# Altium schematic sheet altium.schdoc
size 243 x 176 mm
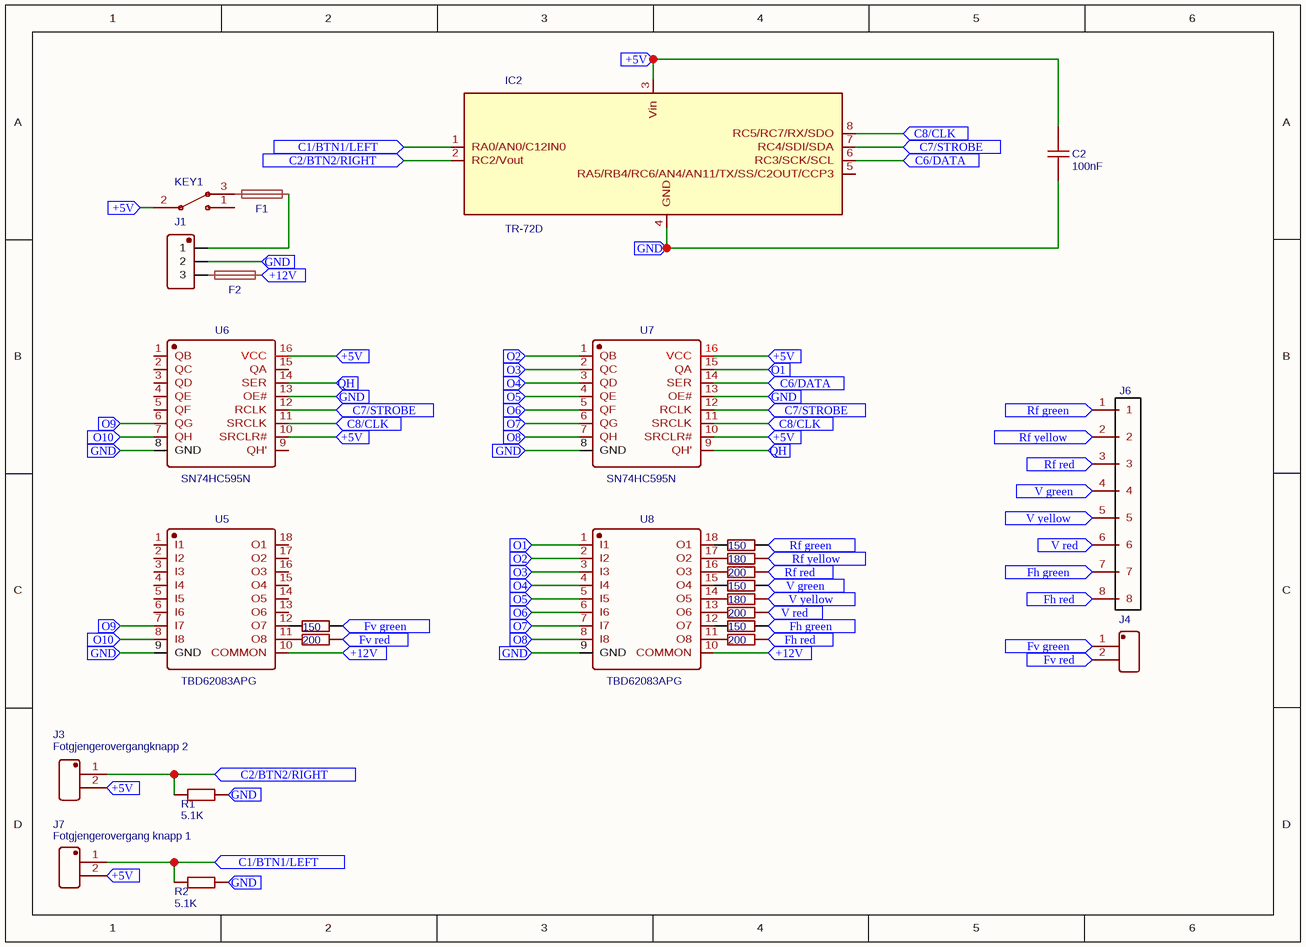
[diagram p0: altium.schdoc]

## Parts
C2  100nF  [1210]
F1  NO  [OMF_125]  (value not drawn)
F2  NO  [OMF_125]  (value not drawn)
IC2  TR-72D  [IQRF_KON-SIM-01]
J1  KF127_3P_5.08  [KF127_3P_5.08]  (value not drawn)
J3  Fotgjengerovergangknapp 2  [KF127_2P_5.08]
J4  KF127_2P_5.08  [KF127_2P_5.08]  (value not drawn)
J6  KF127-8P  [KF127-8P]  (value not drawn)
J7  Fotgjengerovergang knapp 1  [KF127_2P_5.08]
KEY1  MSK-11027 Toggle Switches  [MSK-11027]  (value not drawn)
R1  5.1K  [1206]
R2  5.1K  [1206]
R3  150  [1206]
R4  200  [1206]
R5  200  [1206]
R6  200  [1206]
R7  200  [1206]
R16  180  [1206]
R17  180  [1206]
R18  150  [1206]
R19  150  [1206]
R20  150  [1206]
U5  TBD62083APG  [DIP-18]
U6  SN74HC595N  [DIP-16_L19.8-W6.5-P2.54-LS7.6-BL]
U7  SN74HC595N  [DIP-16_L19.8-W6.5-P2.54-LS7.6-BL]
U8  TBD62083APG  [DIP-18]

## Ports
+5V, +12V, C1/BTN1/LEFT, C2/BTN2/RIGHT, C6/DATA, C7/STROBE, C8/CLK, Fh green, Fh red, Fv green, Fv red, GND, O1, O2, O3, O4, O5, O6, O7, O8, O9, O10, QH, Rf green, Rf red, Rf yellow, V green, V red, V yellow

## Nets
+5V: C2.2 IC2.3(Vin) J3.2(PIN2) J7.2(PIN2) KEY1.2 U6.10(SRCLR#) U6.16(VCC) U7.10(SRCLR#) U7.16(VCC) ; port +5V
+12V: F2.2 U5.10(COMMON) U8.10(COMMON) ; port +12V
C1/BTN1/LEFT: IC2.1(RA0/AN0/C12IN0) J7.1(PIN1) R2.1 ; port C1/BTN1/LEFT
C2/BTN2/RIGHT: IC2.2(RC2/Vout) J3.1(PIN1) R1.1 ; port C2/BTN2/RIGHT
C6/DATA: IC2.6(RC3/SCK/SCL) U7.14(SER) ; port C6/DATA
C7/STROBE: IC2.7(RC4/SDI/SDA) U6.12(RCLK) U7.12(RCLK) ; port C7/STROBE
C8/CLK: IC2.8(RC5/RC7/RX/SDO) U6.11(SRCLK) U7.11(SRCLK) ; port C8/CLK
Fh green: J6.7 R18.2 ; port Fh green
Fh red: J6.8 R5.2 ; port Fh red
Fv green: J4.1(PIN1) R3.2 ; port Fv green
Fv red: J4.2(PIN2) R4.2 ; port Fv red
GND: C2.1 IC2.4(GND) J1.2 R1.2 R2.2 U5.9(GND) U6.8(GND) U6.13(OE#) U7.8(GND) U7.13(OE#) U8.9(GND) ; port GND
O1: U7.15(QA) U8.1(I1) ; port O1
O2: U7.1(QB) U8.2(I2) ; port O2
O3: U7.2(QC) U8.3(I3) ; port O3
O4: U7.3(QD) U8.4(I4) ; port O4
O5: U7.4(QE) U8.5(I5) ; port O5
O6: U7.5(QF) U8.6(I6) ; port O6
O7: U7.6(QG) U8.7(I7) ; port O7
O8: U7.7(QH) U8.8(I8) ; port O8
O9: U5.7(I7) U6.6(QG) ; port O9
O10: U5.8(I8) U6.7(QH) ; port O10
QH: U6.14(SER) U7.9(QH') ; port QH
Rf green: J6.1 R20.2 ; port Rf green
Rf red: J6.3 R7.2 ; port Rf red
Rf yellow: J6.2 R17.2 ; port Rf yellow
V green: J6.4 R19.2 ; port V green
V red: J6.6 R6.2 ; port V red
V yellow: J6.5 R16.2 ; port V yellow
NetF1_1: F1.1 KEY1.3
NetF1_2: F1.2 J1.1
NetF2_1: F2.1 J1.3
NetR3_1: R3.1 U5.12(O7)
NetR4_1: R4.1 U5.11(O8)
NetR5_1: R5.1 U8.11(O8)
NetR6_1: R6.1 U8.13(O6)
NetR7_1: R7.1 U8.16(O3)
NetR16_1: R16.1 U8.14(O5)
NetR17_1: R17.1 U8.17(O2)
NetR18_1: R18.1 U8.12(O7)
NetR19_1: R19.1 U8.15(O4)
NetR20_1: R20.1 U8.18(O1)

Not connected (* = marked no-connect by the designer): IC2 5(RA5/RB4/RC6/AN4/AN11/TX/SS/C2OUT/CCP3); KEY1 1; U5 1(I1) 2(I2) 3(I3) 4(I4) 5(I5) 6(I6) 13(O6) 14(O5) 15(O4) 16(O3) 17(O2) 18(O1); U6 1(QB) 2(QC) 3(QD) 4(QE) 5(QF) 9(QH') 15(QA)

## Library data of the parts
C2 = 100nF: BOM_Manufacturer: Huaxin S&T; BOM_Manufacturer Part: 1210B106K100CT; nameAlias: Capacitance; Contributor: LCSC; BOM_Supplier: LCSC; BOM_Supplier Part: C304011; spicePre: C; spiceSymbolName: 1210B106K100CT
F1 F2 = NO: BOM_Manufacturer Part: 3403.0015.11; Contributor: romiksm; BOM_Supplier: Mouser; BOM_Supplier Part: 693-3403.0015.11; link: https://www.mouser.co.uk/ProductDetail/Schurter/3403001511?qs=sGAEpiMZZMtxU2g%2f1juGqdRmCQF0%252bT4VUkZkHB0fJk4%3d; spicePre: F
IC2 = TR-72D: Contributor: Simen Stensas; license: https://www.gnu.org/licenses/lgpl-2.1.html; spicePre: I
J1 = KF127_3P_5.08: BOM_Manufacturer: Kefa Electronics; Contributor: GrahamG; BOM_Manufacturer Part: KF127_3P_5.08; spicePre: J
J3 = Fotgjengerovergangknapp 2: BOM_Manufacturer: Kefa Electronics; BOM_Manufacturer Part: KF127L-5.08; Contributor: GrahamG; spicePre: J
J4 = KF127_2P_5.08: BOM_Manufacturer: Kefa Electronics; BOM_Manufacturer Part: KF127L-5.08; Contributor: GrahamG; spicePre: J
J6 = KF127-8P: BOM_Manufacturer: CIXI KAIFEN ELECTRONICS CO,. LTDA.; Contributor: milton.sanchez.alban; spicePre: U
J7 = Fotgjengerovergang knapp 1: BOM_Manufacturer: Kefa Electronics; BOM_Manufacturer Part: KF127L-5.08; Contributor: GrahamG; spicePre: J
KEY1 = MSK-11027 Toggle Switches: BOM_Manufacturer: ReliaPro; BOM_Supplier Part: C21381; BOM_Supplier: LCSC; BOM_Manufacturer Part: MSK-11027 Toggle Switches; image: http://image.lceda.cn/szlcsc/C21381.jpg; spicePre: K
R1 R2 = 5.1K: BOM_Manufacturer: Tyohm; BOM_Manufacturer Part: RMC12065.1K1%N; nameAlias: Resistance (Ohms); Contributor: LCSC; BOM_Supplier: LCSC; BOM_Supplier Part: C325932; spicePre: R; spiceSymbolName: RMC12065.1K1%N
R3 R18-R20 = 150: BOM_Manufacturer: YAGEO; BOM_Manufacturer Part: RC1206JR-07160RL; nameAlias: Resistance (Ohms); BOM_Supplier: LCSC; BOM_Supplier Part: C137196; spicePre: R; spiceSymbolName: RC1206JR-07160RL
R4-R7 = 200: BOM_Manufacturer: EVER OHMS; BOM_Manufacturer Part: QR1206J200RP05; nameAlias: Resistance (Ohms); Contributor: LCSC; BOM_Supplier: LCSC; BOM_Supplier Part: C149886; spicePre: R; spiceSymbolName: QR1206J200RP05
R16 R17 = 180: BOM_Manufacturer: BOURNS; BOM_Manufacturer Part: CR1206-FX-1800ELF; nameAlias: Resistance (Ohms); Contributor: LCSC; BOM_Supplier: LCSC; BOM_Supplier Part: C204708; spicePre: R; spiceSymbolName: CR1206-FX-1800ELF
U5 U8 = TBD62083APG: BOM_Manufacturer: TOSHIBA; Contributor: LCSC; BOM_Supplier: LCSC; BOM_Manufacturer Part: TBD62083APG; BOM_Supplier Part: C114143; spicePre: U
U6 U7 = SN74HC595N: BOM_Manufacturer: TI; BOM_Supplier: LCSC; BOM_Manufacturer Part: SN74HC595N; image: //image.lceda.cn/szlcsc/C78711.jpg; BOM_Supplier Part: C78711; spicePre: U